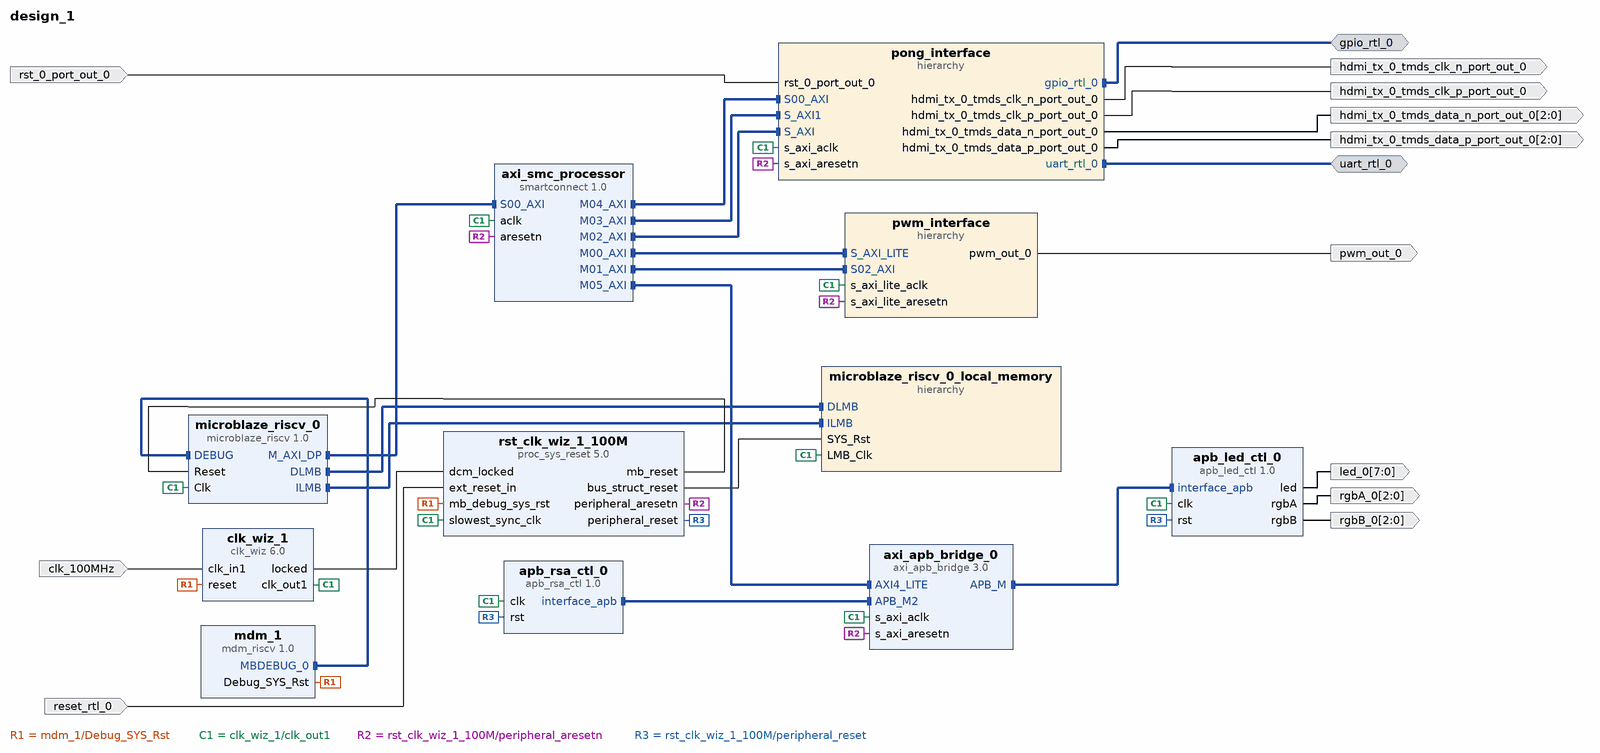
[diagram p0: block diagram of the top level]
# Vivado block design design_1, xc7s50csga324-1, Vivado 2024.2
create_bd_design design_1

create_bd_intf_port -mode Master -vlnv xilinx.com:interface:uart_rtl:1.0 uart_rtl_0
create_bd_intf_port -mode Master -vlnv xilinx.com:interface:gpio_rtl:1.0 gpio_rtl_0
create_bd_port -dir I -type clk clk_100MHz
set_property -dict {CONFIG.FREQ_HZ 100000000} [get_bd_ports clk_100MHz]
create_bd_port -dir I -type rst reset_rtl_0
set_property -dict {CONFIG.POLARITY ACTIVE_LOW} [get_bd_ports reset_rtl_0]
create_bd_port -dir O -from 7 -to 0 led_0
create_bd_port -dir O -from 2 -to 0 rgbA_0
create_bd_port -dir O -from 2 -to 0 rgbB_0
create_bd_port -dir O -from 2 -to 0 hdmi_tx_0_tmds_data_n_port_out_0
create_bd_port -dir I rst_0_port_out_0
create_bd_port -dir O hdmi_tx_0_tmds_clk_n_port_out_0
create_bd_port -dir O hdmi_tx_0_tmds_clk_p_port_out_0
create_bd_port -dir O -from 2 -to 0 hdmi_tx_0_tmds_data_p_port_out_0
create_bd_port -dir O pwm_out_0

create_bd_cell -type ip -vlnv xilinx.com:ip:microblaze_riscv:1.0 microblaze_riscv_0
set_property -dict {CONFIG.C_DEBUG_ENABLED 1 CONFIG.C_D_AXI 1 CONFIG.C_D_LMB 1 CONFIG.C_I_LMB 1} [get_bd_cells microblaze_riscv_0]
create_bd_cell -type hier microblaze_riscv_0_local_memory
create_bd_cell -type ip -vlnv xilinx.com:ip:mdm_riscv:1.0 mdm_1
create_bd_cell -type ip -vlnv xilinx.com:ip:clk_wiz:6.0 clk_wiz_1
set_property -dict {CONFIG.PRIM_SOURCE Single_ended_clock_capable_pin} [get_bd_cells clk_wiz_1]
create_bd_cell -type ip -vlnv xilinx.com:ip:proc_sys_reset:5.0 rst_clk_wiz_1_100M
create_bd_cell -type ip -vlnv xilinx.com:ip:smartconnect:1.0 axi_smc_processor
set_property -dict {CONFIG.NUM_MI 6 CONFIG.NUM_SI 1} [get_bd_cells axi_smc_processor]
create_bd_cell -type ip -vlnv xilinx.com:ip:axi_apb_bridge:3.0 axi_apb_bridge_0
set_property -dict {CONFIG.C_APB_NUM_SLAVES 2} [get_bd_cells axi_apb_bridge_0]
create_bd_cell -type ip -vlnv xilinx.com:user:apb_led_ctl:1.0 apb_led_ctl_0
create_bd_cell -type ip -vlnv xilinx.com:user:apb_rsa_ctl:1.0 apb_rsa_ctl_0
create_bd_cell -type hier pong_interface
create_bd_cell -type hier pwm_interface

# ---- hierarchy /microblaze_riscv_0_local_memory ----
current_bd_instance /microblaze_riscv_0_local_memory
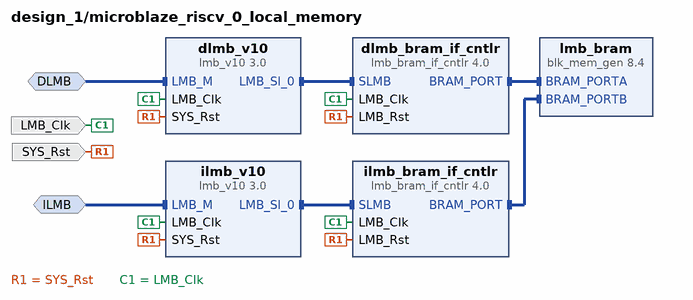
[diagram p1: block diagram inside /microblaze_riscv_0_local_memory]
create_bd_intf_pin -mode MirroredMaster -vlnv xilinx.com:interface:lmb_rtl:1.0 DLMB
create_bd_intf_pin -mode MirroredMaster -vlnv xilinx.com:interface:lmb_rtl:1.0 ILMB
create_bd_pin -dir I -type clk LMB_Clk
create_bd_pin -dir I -type rst SYS_Rst

create_bd_cell -type ip -vlnv xilinx.com:ip:lmb_v10:3.0 dlmb_v10
create_bd_cell -type ip -vlnv xilinx.com:ip:lmb_v10:3.0 ilmb_v10
create_bd_cell -type ip -vlnv xilinx.com:ip:lmb_bram_if_cntlr:4.0 dlmb_bram_if_cntlr
set_property -dict {CONFIG.C_ECC 0} [get_bd_cells dlmb_bram_if_cntlr]
create_bd_cell -type ip -vlnv xilinx.com:ip:lmb_bram_if_cntlr:4.0 ilmb_bram_if_cntlr
set_property -dict {CONFIG.C_ECC 0} [get_bd_cells ilmb_bram_if_cntlr]
create_bd_cell -type ip -vlnv xilinx.com:ip:blk_mem_gen:8.4 lmb_bram
set_property -dict {CONFIG.Memory_Type True_Dual_Port_RAM CONFIG.use_bram_block BRAM_Controller} [get_bd_cells lmb_bram]

# ---- hierarchy /pong_interface ----
current_bd_instance /pong_interface
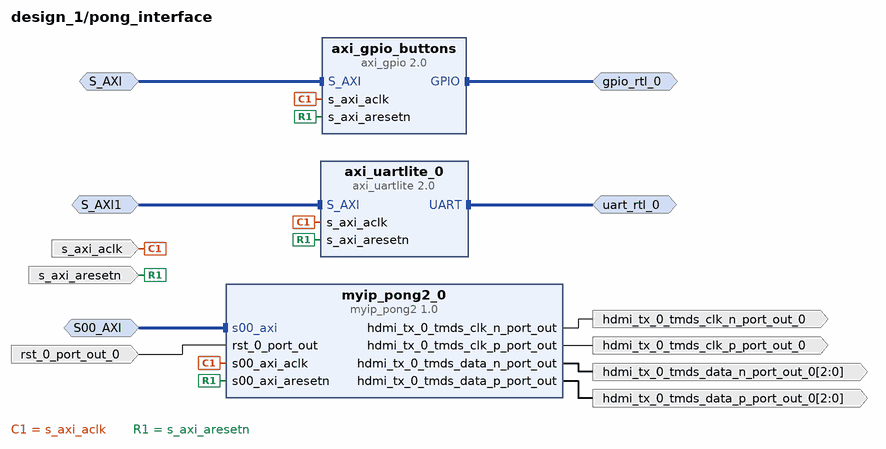
[diagram p2: block diagram inside /pong_interface]
create_bd_intf_pin -mode Slave -vlnv xilinx.com:interface:aximm_rtl:1.0 S_AXI
create_bd_intf_pin -mode Master -vlnv xilinx.com:interface:gpio_rtl:1.0 gpio_rtl_0
create_bd_intf_pin -mode Slave -vlnv xilinx.com:interface:aximm_rtl:1.0 S_AXI1
create_bd_intf_pin -mode Master -vlnv xilinx.com:interface:uart_rtl:1.0 uart_rtl_0
create_bd_intf_pin -mode Slave -vlnv xilinx.com:interface:aximm_rtl:1.0 S00_AXI
create_bd_pin -dir I -type clk s_axi_aclk
create_bd_pin -dir I -type rst s_axi_aresetn
create_bd_pin -dir I rst_0_port_out_0
create_bd_pin -dir O hdmi_tx_0_tmds_clk_n_port_out_0
create_bd_pin -dir O -from 2 -to 0 hdmi_tx_0_tmds_data_n_port_out_0
create_bd_pin -dir O hdmi_tx_0_tmds_clk_p_port_out_0
create_bd_pin -dir O -from 2 -to 0 hdmi_tx_0_tmds_data_p_port_out_0

create_bd_cell -type ip -vlnv xilinx.com:ip:axi_gpio:2.0 axi_gpio_buttons
set_property -dict {CONFIG.C_ALL_INPUTS 1 CONFIG.C_GPIO_WIDTH 2} [get_bd_cells axi_gpio_buttons]
create_bd_cell -type ip -vlnv xilinx.com:ip:axi_uartlite:2.0 axi_uartlite_0
create_bd_cell -type ip -vlnv xilinx.com:user:myip_pong2:1.0 myip_pong2_0
set_property -dict {CONFIG.C_S00_AXI_ADDR_WIDTH 6} [get_bd_cells myip_pong2_0]

# ---- hierarchy /pwm_interface ----
current_bd_instance /pwm_interface
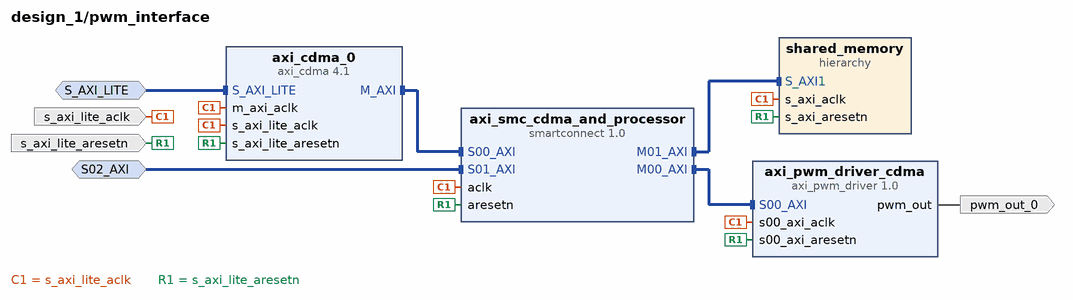
[diagram p3: block diagram inside /pwm_interface]
create_bd_intf_pin -mode Slave -vlnv xilinx.com:interface:aximm_rtl:1.0 S02_AXI
create_bd_intf_pin -mode Slave -vlnv xilinx.com:interface:aximm_rtl:1.0 S_AXI_LITE
create_bd_pin -dir I -type clk s_axi_lite_aclk
create_bd_pin -dir I -type rst s_axi_lite_aresetn
create_bd_pin -dir O pwm_out_0

create_bd_cell -type ip -vlnv xilinx.com:ip:smartconnect:1.0 axi_smc_cdma_and_processor
set_property -dict {CONFIG.NUM_MI 2 CONFIG.NUM_SI 2} [get_bd_cells axi_smc_cdma_and_processor]
create_bd_cell -type ip -vlnv xilinx.com:user:axi_pwm_driver:1.0 axi_pwm_driver_cdma
create_bd_cell -type ip -vlnv xilinx.com:ip:axi_cdma:4.1 axi_cdma_0
set_property -dict {CONFIG.C_INCLUDE_SG 0 CONFIG.C_USE_DATAMOVER_LITE 0} [get_bd_cells axi_cdma_0]
create_bd_cell -type hier shared_memory

# ---- hierarchy /pwm_interface/shared_memory ----
current_bd_instance /pwm_interface/shared_memory
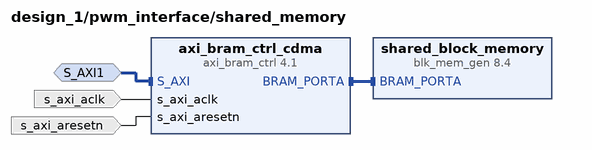
[diagram p4: block diagram inside /pwm_interface/shared_memory]
create_bd_intf_pin -mode Slave -vlnv xilinx.com:interface:aximm_rtl:1.0 S_AXI1
create_bd_pin -dir I -type clk s_axi_aclk
create_bd_pin -dir I -type rst s_axi_aresetn

create_bd_cell -type ip -vlnv xilinx.com:ip:axi_bram_ctrl:4.1 axi_bram_ctrl_cdma
set_property -dict {CONFIG.PROTOCOL AXI4 CONFIG.RD_CMD_OPTIMIZATION 0 CONFIG.SINGLE_PORT_BRAM 1} [get_bd_cells axi_bram_ctrl_cdma]
create_bd_cell -type ip -vlnv xilinx.com:ip:blk_mem_gen:8.4 shared_block_memory
set_property -dict [list \
  CONFIG.Enable_32bit_Address true \
  CONFIG.Memory_Type Single_Port_RAM \
  CONFIG.Register_PortA_Output_of_Memory_Primitives false \
  CONFIG.use_bram_block BRAM_Controller \
] [get_bd_cells shared_block_memory]

# ---- connections ----

current_bd_instance /microblaze_riscv_0_local_memory
connect_bd_intf_net -intf_net microblaze_riscv_0_dlmb [get_bd_intf_pins dlmb_v10/LMB_M] [get_bd_intf_pins DLMB]
connect_bd_intf_net -intf_net microblaze_riscv_0_dlmb_bus [get_bd_intf_pins dlmb_v10/LMB_Sl_0] [get_bd_intf_pins dlmb_bram_if_cntlr/SLMB]
connect_bd_intf_net -intf_net microblaze_riscv_0_dlmb_cntlr [get_bd_intf_pins dlmb_bram_if_cntlr/BRAM_PORT] [get_bd_intf_pins lmb_bram/BRAM_PORTA]
connect_bd_intf_net -intf_net microblaze_riscv_0_ilmb [get_bd_intf_pins ilmb_v10/LMB_M] [get_bd_intf_pins ILMB]
connect_bd_intf_net -intf_net microblaze_riscv_0_ilmb_bus [get_bd_intf_pins ilmb_v10/LMB_Sl_0] [get_bd_intf_pins ilmb_bram_if_cntlr/SLMB]
connect_bd_intf_net -intf_net microblaze_riscv_0_ilmb_cntlr [get_bd_intf_pins ilmb_bram_if_cntlr/BRAM_PORT] [get_bd_intf_pins lmb_bram/BRAM_PORTB]
connect_bd_net [get_bd_pins SYS_Rst] \
  [get_bd_pins dlmb_v10/SYS_Rst] [get_bd_pins dlmb_bram_if_cntlr/LMB_Rst] [get_bd_pins ilmb_v10/SYS_Rst] \
  [get_bd_pins ilmb_bram_if_cntlr/LMB_Rst]
connect_bd_net -net microblaze_riscv_0_Clk [get_bd_pins LMB_Clk] \
  [get_bd_pins dlmb_v10/LMB_Clk] [get_bd_pins dlmb_bram_if_cntlr/LMB_Clk] [get_bd_pins ilmb_v10/LMB_Clk] \
  [get_bd_pins ilmb_bram_if_cntlr/LMB_Clk]
set_property HDL_ATTRIBUTE.BMM_INFO_ADDRESS_SPACE {byte  0x00000000 32 > design_1 microblaze_riscv_0_local_memory/lmb_bram} [get_bd_cells dlmb_bram_if_cntlr]
set_property HDL_ATTRIBUTE.KEEP_HIERARCHY yes [get_bd_cells dlmb_bram_if_cntlr]

current_bd_instance /pong_interface
connect_bd_intf_net [get_bd_intf_pins S00_AXI] [get_bd_intf_pins myip_pong2_0/s00_axi]
connect_bd_intf_net -intf_net axi_gpio_0_GPIO [get_bd_intf_pins gpio_rtl_0] [get_bd_intf_pins axi_gpio_buttons/GPIO]
connect_bd_intf_net -intf_net axi_smc_M00_AXI [get_bd_intf_pins S_AXI1] [get_bd_intf_pins axi_uartlite_0/S_AXI]
connect_bd_intf_net -intf_net axi_smc_M02_AXI [get_bd_intf_pins S_AXI] [get_bd_intf_pins axi_gpio_buttons/S_AXI]
connect_bd_intf_net [get_bd_intf_pins uart_rtl_0] [get_bd_intf_pins axi_uartlite_0/UART]
connect_bd_net -net microblaze_riscv_0_Clk [get_bd_pins s_axi_aclk] \
  [get_bd_pins axi_uartlite_0/s_axi_aclk] [get_bd_pins axi_gpio_buttons/s_axi_aclk] [get_bd_pins myip_pong2_0/s00_axi_aclk]
connect_bd_net [get_bd_pins myip_pong2_0/hdmi_tx_0_tmds_clk_n_port_out] [get_bd_pins hdmi_tx_0_tmds_clk_n_port_out_0]
connect_bd_net [get_bd_pins myip_pong2_0/hdmi_tx_0_tmds_clk_p_port_out] [get_bd_pins hdmi_tx_0_tmds_clk_p_port_out_0]
connect_bd_net [get_bd_pins myip_pong2_0/hdmi_tx_0_tmds_data_n_port_out] [get_bd_pins hdmi_tx_0_tmds_data_n_port_out_0]
connect_bd_net [get_bd_pins myip_pong2_0/hdmi_tx_0_tmds_data_p_port_out] [get_bd_pins hdmi_tx_0_tmds_data_p_port_out_0]
connect_bd_net -net rst_0_port_out_0_1 [get_bd_pins rst_0_port_out_0] [get_bd_pins myip_pong2_0/rst_0_port_out]
connect_bd_net -net rst_clk_wiz_1_100M_peripheral_aresetn [get_bd_pins s_axi_aresetn] \
  [get_bd_pins axi_uartlite_0/s_axi_aresetn] [get_bd_pins axi_gpio_buttons/s_axi_aresetn] \
  [get_bd_pins myip_pong2_0/s00_axi_aresetn]

current_bd_instance /pwm_interface
connect_bd_intf_net [get_bd_intf_pins S02_AXI] [get_bd_intf_pins axi_smc_cdma_and_processor/S01_AXI]
connect_bd_intf_net [get_bd_intf_pins axi_smc_cdma_and_processor/S00_AXI] [get_bd_intf_pins axi_cdma_0/M_AXI]
connect_bd_intf_net -intf_net axi_smc_M00_AXI [get_bd_intf_pins S_AXI_LITE] [get_bd_intf_pins axi_cdma_0/S_AXI_LITE]
connect_bd_intf_net -intf_net smartconnect_0_M00_AXI [get_bd_intf_pins axi_smc_cdma_and_processor/M00_AXI] [get_bd_intf_pins axi_pwm_driver_cdma/S00_AXI]
connect_bd_intf_net -intf_net smartconnect_0_M01_AXI [get_bd_intf_pins axi_smc_cdma_and_processor/M01_AXI] [get_bd_intf_pins shared_memory/S_AXI1]
connect_bd_net -net axi_pwm_driver_0_pwm_out [get_bd_pins axi_pwm_driver_cdma/pwm_out] [get_bd_pins pwm_out_0]
connect_bd_net -net microblaze_riscv_0_Clk [get_bd_pins s_axi_lite_aclk] \
  [get_bd_pins axi_cdma_0/s_axi_lite_aclk] [get_bd_pins axi_cdma_0/m_axi_aclk] [get_bd_pins shared_memory/s_axi_aclk] \
  [get_bd_pins axi_pwm_driver_cdma/s00_axi_aclk] [get_bd_pins axi_smc_cdma_and_processor/aclk]
connect_bd_net -net rst_clk_wiz_1_100M_peripheral_aresetn [get_bd_pins s_axi_lite_aresetn] \
  [get_bd_pins axi_cdma_0/s_axi_lite_aresetn] [get_bd_pins shared_memory/s_axi_aresetn] \
  [get_bd_pins axi_pwm_driver_cdma/s00_axi_aresetn] [get_bd_pins axi_smc_cdma_and_processor/aresetn]

current_bd_instance /pwm_interface/shared_memory
connect_bd_intf_net -intf_net axi_bram_ctrl_processor_BRAM_PORTA [get_bd_intf_pins axi_bram_ctrl_cdma/BRAM_PORTA] [get_bd_intf_pins shared_block_memory/BRAM_PORTA]
connect_bd_intf_net -intf_net axi_smc_M05_AXI [get_bd_intf_pins S_AXI1] [get_bd_intf_pins axi_bram_ctrl_cdma/S_AXI]
connect_bd_net -net microblaze_riscv_0_Clk [get_bd_pins s_axi_aclk] [get_bd_pins axi_bram_ctrl_cdma/s_axi_aclk]
connect_bd_net -net rst_clk_wiz_1_100M_peripheral_aresetn [get_bd_pins s_axi_aresetn] [get_bd_pins axi_bram_ctrl_cdma/s_axi_aresetn]
set_property HDL_ATTRIBUTE.BMM_INFO_ADDRESS_SPACE {byte  0xC0000000 32 > design_1 pwm_interface/shared_memory/shared_block_memory} [get_bd_cells axi_bram_ctrl_cdma]
set_property HDL_ATTRIBUTE.KEEP_HIERARCHY yes [get_bd_cells axi_bram_ctrl_cdma]

current_bd_instance /
connect_bd_intf_net [get_bd_intf_pins pong_interface/S00_AXI] [get_bd_intf_pins axi_smc_processor/M04_AXI]
connect_bd_intf_net -intf_net S_AXI1_1 [get_bd_intf_pins pong_interface/S_AXI1] [get_bd_intf_pins axi_smc_processor/M03_AXI]
connect_bd_intf_net [get_bd_intf_pins pong_interface/S_AXI] [get_bd_intf_pins axi_smc_processor/M02_AXI]
connect_bd_intf_net [get_bd_intf_pins apb_led_ctl_0/interface_apb] [get_bd_intf_pins axi_apb_bridge_0/APB_M]
connect_bd_intf_net [get_bd_intf_pins apb_rsa_ctl_0/interface_apb] [get_bd_intf_pins axi_apb_bridge_0/APB_M2]
connect_bd_intf_net -intf_net axi_gpio_0_GPIO [get_bd_intf_ports gpio_rtl_0] [get_bd_intf_pins pong_interface/gpio_rtl_0]
connect_bd_intf_net -intf_net axi_smc_M00_AXI [get_bd_intf_pins pwm_interface/S_AXI_LITE] [get_bd_intf_pins axi_smc_processor/M00_AXI]
connect_bd_intf_net [get_bd_intf_pins axi_smc_processor/M01_AXI] [get_bd_intf_pins pwm_interface/S02_AXI]
connect_bd_intf_net [get_bd_intf_pins axi_apb_bridge_0/AXI4_LITE] [get_bd_intf_pins axi_smc_processor/M05_AXI]
connect_bd_intf_net -intf_net axi_uartlite_0_UART [get_bd_intf_ports uart_rtl_0] [get_bd_intf_pins pong_interface/uart_rtl_0]
connect_bd_intf_net [get_bd_intf_pins microblaze_riscv_0/M_AXI_DP] [get_bd_intf_pins axi_smc_processor/S00_AXI]
connect_bd_intf_net [get_bd_intf_pins mdm_1/MBDEBUG_0] [get_bd_intf_pins microblaze_riscv_0/DEBUG]
connect_bd_intf_net [get_bd_intf_pins microblaze_riscv_0/DLMB] [get_bd_intf_pins microblaze_riscv_0_local_memory/DLMB]
connect_bd_intf_net [get_bd_intf_pins microblaze_riscv_0/ILMB] [get_bd_intf_pins microblaze_riscv_0_local_memory/ILMB]
connect_bd_net [get_bd_pins apb_led_ctl_0/led] [get_bd_ports led_0]
connect_bd_net [get_bd_pins apb_led_ctl_0/rgbA] [get_bd_ports rgbA_0]
connect_bd_net [get_bd_pins apb_led_ctl_0/rgbB] [get_bd_ports rgbB_0]
connect_bd_net -net axi_pwm_driver_0_pwm_out [get_bd_pins pwm_interface/pwm_out_0] [get_bd_ports pwm_out_0]
connect_bd_net [get_bd_ports clk_100MHz] [get_bd_pins clk_wiz_1/clk_in1]
connect_bd_net [get_bd_pins clk_wiz_1/locked] [get_bd_pins rst_clk_wiz_1_100M/dcm_locked]
connect_bd_net [get_bd_pins mdm_1/Debug_SYS_Rst] [get_bd_pins rst_clk_wiz_1_100M/mb_debug_sys_rst] [get_bd_pins clk_wiz_1/reset]
connect_bd_net -net microblaze_riscv_0_Clk [get_bd_pins clk_wiz_1/clk_out1] \
  [get_bd_pins microblaze_riscv_0/Clk] [get_bd_pins microblaze_riscv_0_local_memory/LMB_Clk] \
  [get_bd_pins rst_clk_wiz_1_100M/slowest_sync_clk] [get_bd_pins axi_smc_processor/aclk] [get_bd_pins apb_led_ctl_0/clk] \
  [get_bd_pins axi_apb_bridge_0/s_axi_aclk] [get_bd_pins pong_interface/s_axi_aclk] [get_bd_pins apb_rsa_ctl_0/clk] \
  [get_bd_pins pwm_interface/s_axi_lite_aclk]
connect_bd_net -net myip_pong2_v2_0_hdmi_tx_0_tmds_clk_n_port_out [get_bd_pins pong_interface/hdmi_tx_0_tmds_clk_n_port_out_0] \
  [get_bd_ports hdmi_tx_0_tmds_clk_n_port_out_0]
connect_bd_net -net myip_pong2_v2_0_hdmi_tx_0_tmds_clk_p_port_out [get_bd_pins pong_interface/hdmi_tx_0_tmds_clk_p_port_out_0] \
  [get_bd_ports hdmi_tx_0_tmds_clk_p_port_out_0]
connect_bd_net -net myip_pong2_v2_0_hdmi_tx_0_tmds_data_n_port_out [get_bd_pins pong_interface/hdmi_tx_0_tmds_data_n_port_out_0] \
  [get_bd_ports hdmi_tx_0_tmds_data_n_port_out_0]
connect_bd_net -net myip_pong2_v2_0_hdmi_tx_0_tmds_data_p_port_out [get_bd_pins pong_interface/hdmi_tx_0_tmds_data_p_port_out_0] \
  [get_bd_ports hdmi_tx_0_tmds_data_p_port_out_0]
connect_bd_net -net reset_rtl_0_1 [get_bd_ports reset_rtl_0] [get_bd_pins rst_clk_wiz_1_100M/ext_reset_in]
connect_bd_net -net rst_0_port_out_0_1 [get_bd_ports rst_0_port_out_0] [get_bd_pins pong_interface/rst_0_port_out_0]
connect_bd_net [get_bd_pins rst_clk_wiz_1_100M/bus_struct_reset] [get_bd_pins microblaze_riscv_0_local_memory/SYS_Rst]
connect_bd_net [get_bd_pins rst_clk_wiz_1_100M/mb_reset] [get_bd_pins microblaze_riscv_0/Reset]
connect_bd_net [get_bd_pins rst_clk_wiz_1_100M/peripheral_aresetn] \
  [get_bd_pins axi_smc_processor/aresetn] [get_bd_pins axi_apb_bridge_0/s_axi_aresetn] \
  [get_bd_pins pong_interface/s_axi_aresetn] [get_bd_pins pwm_interface/s_axi_lite_aresetn]
connect_bd_net [get_bd_pins rst_clk_wiz_1_100M/peripheral_reset] [get_bd_pins apb_led_ctl_0/rst] [get_bd_pins apb_rsa_ctl_0/rst]
set_property HDL_ATTRIBUTE.BMM_INFO_PROCESSOR {riscv > design_1 microblaze_riscv_0_local_memory/dlmb_bram_if_cntlr design_1 pwm_interface/shared_memory/axi_bram_ctrl_cdma} [get_bd_cells microblaze_riscv_0]
set_property HDL_ATTRIBUTE.KEEP_HIERARCHY yes [get_bd_cells microblaze_riscv_0]

# ---- address map ----
assign_bd_address -offset 0x00000000 -range 128K -target_address_space [get_bd_addr_spaces microblaze_riscv_0/Data] [get_bd_addr_segs microblaze_riscv_0_local_memory/dlmb_bram_if_cntlr/SLMB/Mem]
assign_bd_address -offset 0x0C004000 -range 4K -target_address_space [get_bd_addr_spaces microblaze_riscv_0/Data] [get_bd_addr_segs pong_interface/myip_pong2_0/s00_axi/reg0]
assign_bd_address -offset 0x40000000 -range 64K -target_address_space [get_bd_addr_spaces microblaze_riscv_0/Data] [get_bd_addr_segs pong_interface/axi_gpio_buttons/S_AXI/Reg]
assign_bd_address -offset 0x40600000 -range 64K -target_address_space [get_bd_addr_spaces microblaze_riscv_0/Data] [get_bd_addr_segs pong_interface/axi_uartlite_0/S_AXI/Reg]
assign_bd_address -offset 0x44A00000 -range 64K -target_address_space [get_bd_addr_spaces microblaze_riscv_0/Data] [get_bd_addr_segs apb_led_ctl_0/interface_apb/apb_mm_led]
assign_bd_address -offset 0x44A10000 -range 64K -target_address_space [get_bd_addr_spaces microblaze_riscv_0/Data] [get_bd_addr_segs apb_rsa_ctl_0/interface_apb_mm/abp_addr_block]
assign_bd_address -offset 0x44A20000 -range 64K -target_address_space [get_bd_addr_spaces microblaze_riscv_0/Data] [get_bd_addr_segs pwm_interface/axi_cdma_0/S_AXI_LITE/Reg]
assign_bd_address -offset 0x76000000 -range 64K -target_address_space [get_bd_addr_spaces microblaze_riscv_0/Data] [get_bd_addr_segs pwm_interface/axi_pwm_driver_cdma/S00_AXI/S00_AXI_reg]
assign_bd_address -offset 0xC0000000 -range 128K -target_address_space [get_bd_addr_spaces microblaze_riscv_0/Data] [get_bd_addr_segs pwm_interface/shared_memory/axi_bram_ctrl_cdma/S_AXI/Mem0]
assign_bd_address -offset 0x00000000 -range 128K -target_address_space [get_bd_addr_spaces microblaze_riscv_0/Instruction] [get_bd_addr_segs microblaze_riscv_0_local_memory/ilmb_bram_if_cntlr/SLMB/Mem]
assign_bd_address -offset 0x76000000 -range 64K -target_address_space [get_bd_addr_spaces pwm_interface/axi_cdma_0/Data] [get_bd_addr_segs pwm_interface/axi_pwm_driver_cdma/S00_AXI/S00_AXI_reg]
assign_bd_address -offset 0xC0000000 -range 128K -target_address_space [get_bd_addr_spaces pwm_interface/axi_cdma_0/Data] [get_bd_addr_segs pwm_interface/shared_memory/axi_bram_ctrl_cdma/S_AXI/Mem0]
assign_bd_address -offset 0x76000000 -range 64K -target_address_space [get_bd_addr_spaces pwm_interface/axi_cdma_0/Data_SG] [get_bd_addr_segs pwm_interface/axi_pwm_driver_cdma/S00_AXI/S00_AXI_reg]
assign_bd_address -offset 0xC0000000 -range 256K -target_address_space [get_bd_addr_spaces pwm_interface/axi_cdma_0/Data_SG] [get_bd_addr_segs pwm_interface/shared_memory/axi_bram_ctrl_cdma/S_AXI/Mem0]

validate_bd_design
save_bd_design
